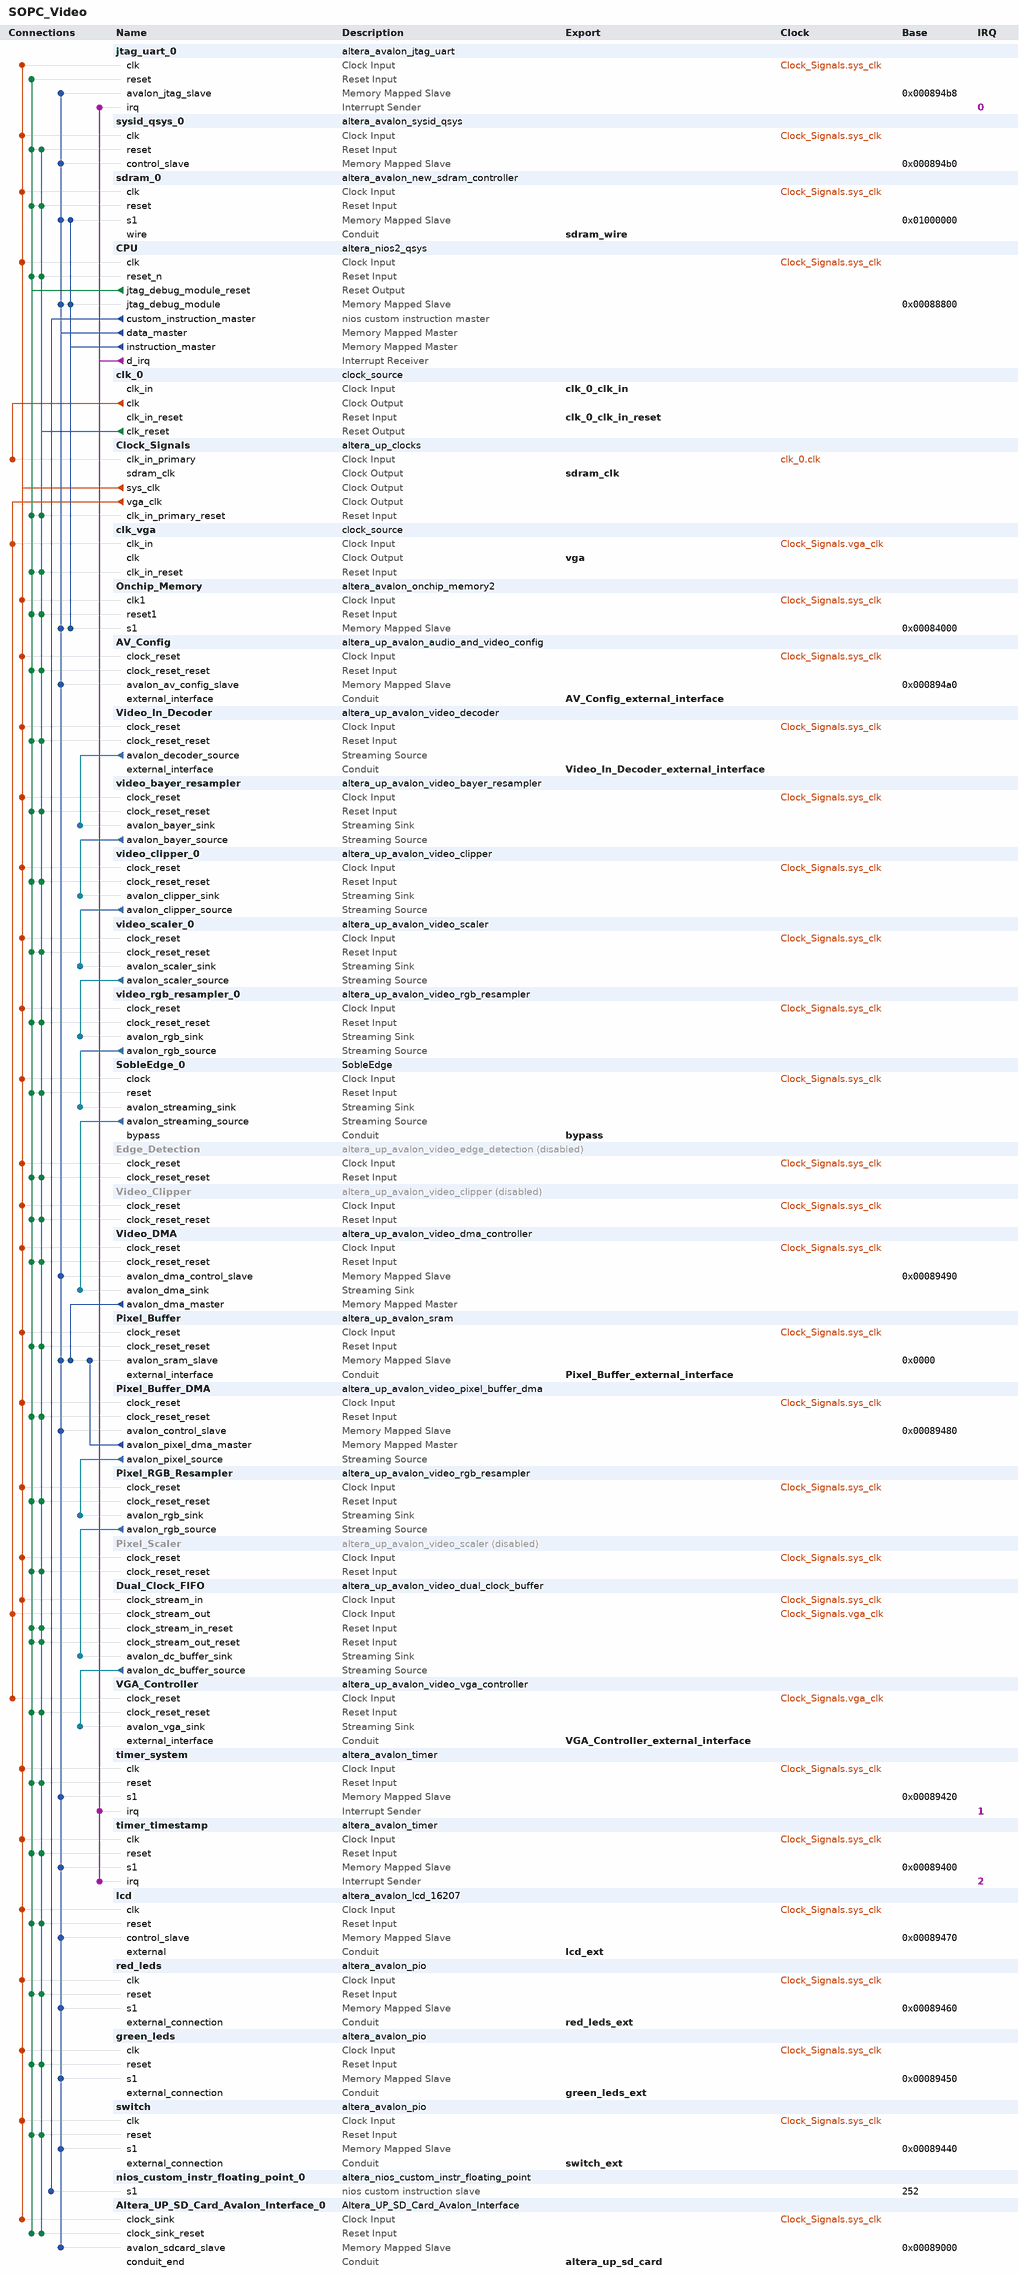
[diagram p0: system contents]
# Platform Designer (Qsys) system SOPC_Video, Cyclone II EP2C35F672C6
# Parameters at their usual value, and those the tool derives, are not listed.
package require -exact qsys 12.0
create_system SOPC_Video
set_project_property DEVICE_FAMILY {Cyclone II}
set_project_property DEVICE EP2C35F672C6

add_instance jtag_uart_0 altera_avalon_jtag_uart 12.1
set_instance_parameter_value jtag_uart_0 simInteractiveOptions INTERACTIVE_ASCII_OUTPUT

add_instance sysid_qsys_0 altera_avalon_sysid_qsys 12.1
set_instance_parameter_value sysid_qsys_0 id 287454020

add_instance sdram_0 altera_avalon_new_sdram_controller 12.1
set_instance_parameter_value sdram_0 TAC 5.5
set_instance_parameter_value sdram_0 TRCD 20.0
set_instance_parameter_value sdram_0 TRP 20.0
set_instance_parameter_value sdram_0 casLatency 3
set_instance_parameter_value sdram_0 columnWidth 8
set_instance_parameter_value sdram_0 dataWidth 16
set_instance_parameter_value sdram_0 generateSimulationModel false
set_instance_parameter_value sdram_0 model custom
set_instance_parameter_value sdram_0 numberOfBanks 4
set_instance_parameter_value sdram_0 numberOfChipSelects 1
set_instance_parameter_value sdram_0 powerUpDelay 100.0
set_instance_parameter_value sdram_0 refreshPeriod 15.625
set_instance_parameter_value sdram_0 rowWidth 12

add_instance CPU altera_nios2_qsys 12.1
set_instance_parameter_value CPU muldiv_divider true
set_instance_parameter_value CPU manuallyAssignCpuID false
set_instance_parameter_value CPU resetSlave sdram_0.s1
set_instance_parameter_value CPU exceptionSlave sdram_0.s1
set_instance_parameter_value CPU breakSlave CPU.jtag_debug_module
set_instance_parameter_value CPU impl Small
set_instance_parameter_value CPU icache_size 4096
set_instance_parameter_value CPU debug_level Level2

add_instance clk_0 clock_source 12.1
set_instance_parameter_value clk_0 clockFrequency 50000000

add_instance Clock_Signals altera_up_clocks 12.0
set_instance_parameter_value Clock_Signals board DE2
set_instance_parameter_value Clock_Signals vga_clk true
set_instance_parameter_value Clock_Signals audio_clk false
set_instance_parameter_value Clock_Signals audio_clk_freq 12.288

add_instance clk_vga clock_source 12.1
set_instance_parameter_value clk_vga clockFrequency 25000000

add_instance Onchip_Memory altera_avalon_onchip_memory2 12.1
set_instance_parameter_value Onchip_Memory dataWidth 32
set_instance_parameter_value Onchip_Memory dualPort false
set_instance_parameter_value Onchip_Memory initMemContent true
set_instance_parameter_value Onchip_Memory initializationFileName Onchip_Memory
set_instance_parameter_value Onchip_Memory memorySize 16384

add_instance AV_Config altera_up_avalon_audio_and_video_config 12.0
set_instance_parameter_value AV_Config board DE2
set_instance_parameter_value AV_Config audio_in {Microphone to ADC}
set_instance_parameter_value AV_Config line_in_bypass false
set_instance_parameter_value AV_Config bit_length 24
set_instance_parameter_value AV_Config sampling_rate {48 kHz}
set_instance_parameter_value AV_Config video_format PAL

add_instance Video_In_Decoder altera_up_avalon_video_decoder 12.0
set_instance_parameter_value Video_In_Decoder video_source {5MP Daughtercard (THDB_D5M)}

add_instance video_bayer_resampler altera_up_avalon_video_bayer_resampler 12.0
set_instance_parameter_value video_bayer_resampler use_custom_format true
set_instance_parameter_value video_bayer_resampler custom_width_in 1280
set_instance_parameter_value video_bayer_resampler custom_height_in 1024

add_instance video_clipper_0 altera_up_avalon_video_clipper 12.0
set_instance_parameter_value video_clipper_0 width_in 1296
set_instance_parameter_value video_clipper_0 height_in 972
set_instance_parameter_value video_clipper_0 drop_left 8
set_instance_parameter_value video_clipper_0 drop_right 8
set_instance_parameter_value video_clipper_0 drop_top 6
set_instance_parameter_value video_clipper_0 drop_bottom 6
set_instance_parameter_value video_clipper_0 color_bits 8
set_instance_parameter_value video_clipper_0 color_planes 3

add_instance video_scaler_0 altera_up_avalon_video_scaler 12.0
set_instance_parameter_value video_scaler_0 width_scaling 0.5
set_instance_parameter_value video_scaler_0 height_scaling 0.5
set_instance_parameter_value video_scaler_0 width_in 1280
set_instance_parameter_value video_scaler_0 height_in 960
set_instance_parameter_value video_scaler_0 color_bits 8
set_instance_parameter_value video_scaler_0 color_planes 3

add_instance video_rgb_resampler_0 altera_up_avalon_video_rgb_resampler 12.0
set_instance_parameter_value video_rgb_resampler_0 input_type {24-bit RGB}
set_instance_parameter_value video_rgb_resampler_0 output_type {8-bit Grayscale}
set_instance_parameter_value video_rgb_resampler_0 alpha 1023

add_instance SobleEdge_0 SobleEdge 1.0
set_instance_parameter_value SobleEdge_0 WIDTH 640

add_instance Edge_Detection altera_up_avalon_video_edge_detection 12.0
set_instance_property Edge_Detection ENABLED false
set_instance_parameter_value Edge_Detection width 640
set_instance_parameter_value Edge_Detection intensity 1

add_instance Video_Clipper altera_up_avalon_video_clipper 12.0
set_instance_property Video_Clipper ENABLED false
set_instance_parameter_value Video_Clipper width_in 800
set_instance_parameter_value Video_Clipper height_in 600
set_instance_parameter_value Video_Clipper drop_left 80
set_instance_parameter_value Video_Clipper drop_right 80
set_instance_parameter_value Video_Clipper drop_top 60
set_instance_parameter_value Video_Clipper drop_bottom 60
set_instance_parameter_value Video_Clipper color_bits 8
set_instance_parameter_value Video_Clipper color_planes 1

add_instance Video_DMA altera_up_avalon_video_dma_controller 12.0
set_instance_parameter_value Video_DMA mode {From Stream to Memory}
set_instance_parameter_value Video_DMA addr_mode X-Y
set_instance_parameter_value Video_DMA start_address 0
set_instance_parameter_value Video_DMA back_start_address 0
set_instance_parameter_value Video_DMA width 640
set_instance_parameter_value Video_DMA height 480
set_instance_parameter_value Video_DMA color_bits 8
set_instance_parameter_value Video_DMA color_planes 1

add_instance Pixel_Buffer altera_up_avalon_sram 12.0
set_instance_parameter_value Pixel_Buffer board DE2
set_instance_parameter_value Pixel_Buffer pixel_buffer true

add_instance Pixel_Buffer_DMA altera_up_avalon_video_pixel_buffer_dma 12.0
set_instance_parameter_value Pixel_Buffer_DMA addr_mode X-Y
set_instance_parameter_value Pixel_Buffer_DMA start_address 0
set_instance_parameter_value Pixel_Buffer_DMA back_start_address 0
set_instance_parameter_value Pixel_Buffer_DMA image_width 640
set_instance_parameter_value Pixel_Buffer_DMA image_height 480
set_instance_parameter_value Pixel_Buffer_DMA color_space {8-bit Grayscale}

add_instance Pixel_RGB_Resampler altera_up_avalon_video_rgb_resampler 12.0
set_instance_parameter_value Pixel_RGB_Resampler input_type {8-bit Grayscale}
set_instance_parameter_value Pixel_RGB_Resampler output_type {30-bit RGB}
set_instance_parameter_value Pixel_RGB_Resampler alpha 255

add_instance Pixel_Scaler altera_up_avalon_video_scaler 12.0
set_instance_property Pixel_Scaler ENABLED false
set_instance_parameter_value Pixel_Scaler width_scaling 1
set_instance_parameter_value Pixel_Scaler height_scaling 1
set_instance_parameter_value Pixel_Scaler width_in 640
set_instance_parameter_value Pixel_Scaler height_in 480
set_instance_parameter_value Pixel_Scaler color_bits 10
set_instance_parameter_value Pixel_Scaler color_planes 3

add_instance Dual_Clock_FIFO altera_up_avalon_video_dual_clock_buffer 12.0
set_instance_parameter_value Dual_Clock_FIFO color_bits 10

add_instance VGA_Controller altera_up_avalon_video_vga_controller 12.0
set_instance_parameter_value VGA_Controller board DE2

add_instance timer_system altera_avalon_timer 12.1
set_instance_parameter_value timer_system period 1
set_instance_parameter_value timer_system periodUnits MSEC
set_instance_parameter_value timer_system timerPreset FULL_FEATURED

add_instance timer_timestamp altera_avalon_timer 12.1
set_instance_parameter_value timer_timestamp period 1
set_instance_parameter_value timer_timestamp periodUnits MSEC
set_instance_parameter_value timer_timestamp timerPreset FULL_FEATURED

add_instance lcd altera_avalon_lcd_16207 12.1

add_instance red_leds altera_avalon_pio 12.1
set_instance_parameter_value red_leds direction Output
set_instance_parameter_value red_leds width 8

add_instance green_leds altera_avalon_pio 12.1
set_instance_parameter_value green_leds direction Output
set_instance_parameter_value green_leds width 8

add_instance switch altera_avalon_pio 12.1
set_instance_parameter_value switch direction Input
set_instance_parameter_value switch width 8

add_instance nios_custom_instr_floating_point_0 altera_nios_custom_instr_floating_point 12.1
set_instance_parameter_value nios_custom_instr_floating_point_0 useDivider 0

add_instance Altera_UP_SD_Card_Avalon_Interface_0 Altera_UP_SD_Card_Avalon_Interface 1.0

# connections
add_connection clk_0.clk Clock_Signals.clk_in_primary clock
add_connection Clock_Signals.sys_clk Altera_UP_SD_Card_Avalon_Interface_0.clock_sink clock
add_connection Clock_Signals.sys_clk AV_Config.clock_reset clock
add_connection Clock_Signals.sys_clk CPU.clk clock
add_connection Clock_Signals.sys_clk Dual_Clock_FIFO.clock_stream_in clock
add_connection Clock_Signals.sys_clk Edge_Detection.clock_reset clock
add_connection Clock_Signals.sys_clk green_leds.clk clock
add_connection Clock_Signals.sys_clk jtag_uart_0.clk clock
add_connection Clock_Signals.sys_clk lcd.clk clock
add_connection Clock_Signals.sys_clk Onchip_Memory.clk1 clock
add_connection Clock_Signals.sys_clk Pixel_Buffer.clock_reset clock
add_connection Clock_Signals.sys_clk Pixel_Buffer_DMA.clock_reset clock
add_connection Clock_Signals.sys_clk Pixel_RGB_Resampler.clock_reset clock
add_connection Clock_Signals.sys_clk Pixel_Scaler.clock_reset clock
add_connection Clock_Signals.sys_clk red_leds.clk clock
add_connection Clock_Signals.sys_clk sdram_0.clk clock
add_connection Clock_Signals.sys_clk SobleEdge_0.clock clock
add_connection Clock_Signals.sys_clk switch.clk clock
add_connection Clock_Signals.sys_clk sysid_qsys_0.clk clock
add_connection Clock_Signals.sys_clk timer_system.clk clock
add_connection Clock_Signals.sys_clk timer_timestamp.clk clock
add_connection Clock_Signals.sys_clk video_bayer_resampler.clock_reset clock
add_connection Clock_Signals.sys_clk Video_Clipper.clock_reset clock
add_connection Clock_Signals.sys_clk video_clipper_0.clock_reset clock
add_connection Clock_Signals.sys_clk Video_DMA.clock_reset clock
add_connection Clock_Signals.sys_clk Video_In_Decoder.clock_reset clock
add_connection Clock_Signals.sys_clk video_rgb_resampler_0.clock_reset clock
add_connection Clock_Signals.sys_clk video_scaler_0.clock_reset clock
add_connection Clock_Signals.vga_clk clk_vga.clk_in clock
add_connection Clock_Signals.vga_clk Dual_Clock_FIFO.clock_stream_out clock
add_connection Clock_Signals.vga_clk VGA_Controller.clock_reset clock
add_connection clk_0.clk_reset Altera_UP_SD_Card_Avalon_Interface_0.clock_sink_reset reset
add_connection clk_0.clk_reset AV_Config.clock_reset_reset reset
add_connection clk_0.clk_reset clk_vga.clk_in_reset reset
add_connection clk_0.clk_reset Clock_Signals.clk_in_primary_reset reset
add_connection clk_0.clk_reset CPU.reset_n reset
add_connection clk_0.clk_reset Dual_Clock_FIFO.clock_stream_in_reset reset
add_connection clk_0.clk_reset Dual_Clock_FIFO.clock_stream_out_reset reset
add_connection clk_0.clk_reset Edge_Detection.clock_reset_reset reset
add_connection clk_0.clk_reset green_leds.reset reset
add_connection clk_0.clk_reset lcd.reset reset
add_connection clk_0.clk_reset Onchip_Memory.reset1 reset
add_connection clk_0.clk_reset Pixel_Buffer.clock_reset_reset reset
add_connection clk_0.clk_reset Pixel_Buffer_DMA.clock_reset_reset reset
add_connection clk_0.clk_reset Pixel_RGB_Resampler.clock_reset_reset reset
add_connection clk_0.clk_reset Pixel_Scaler.clock_reset_reset reset
add_connection clk_0.clk_reset red_leds.reset reset
add_connection clk_0.clk_reset sdram_0.reset reset
add_connection clk_0.clk_reset SobleEdge_0.reset reset
add_connection clk_0.clk_reset switch.reset reset
add_connection clk_0.clk_reset sysid_qsys_0.reset reset
add_connection clk_0.clk_reset timer_system.reset reset
add_connection clk_0.clk_reset timer_timestamp.reset reset
add_connection clk_0.clk_reset VGA_Controller.clock_reset_reset reset
add_connection clk_0.clk_reset video_bayer_resampler.clock_reset_reset reset
add_connection clk_0.clk_reset Video_Clipper.clock_reset_reset reset
add_connection clk_0.clk_reset video_clipper_0.clock_reset_reset reset
add_connection clk_0.clk_reset Video_DMA.clock_reset_reset reset
add_connection clk_0.clk_reset Video_In_Decoder.clock_reset_reset reset
add_connection clk_0.clk_reset video_rgb_resampler_0.clock_reset_reset reset
add_connection clk_0.clk_reset video_scaler_0.clock_reset_reset reset
add_connection CPU.jtag_debug_module_reset Altera_UP_SD_Card_Avalon_Interface_0.clock_sink_reset reset
add_connection CPU.jtag_debug_module_reset AV_Config.clock_reset_reset reset
add_connection CPU.jtag_debug_module_reset clk_vga.clk_in_reset reset
add_connection CPU.jtag_debug_module_reset Clock_Signals.clk_in_primary_reset reset
add_connection CPU.jtag_debug_module_reset CPU.reset_n reset
add_connection CPU.jtag_debug_module_reset Dual_Clock_FIFO.clock_stream_in_reset reset
add_connection CPU.jtag_debug_module_reset Dual_Clock_FIFO.clock_stream_out_reset reset
add_connection CPU.jtag_debug_module_reset Edge_Detection.clock_reset_reset reset
add_connection CPU.jtag_debug_module_reset green_leds.reset reset
add_connection CPU.jtag_debug_module_reset jtag_uart_0.reset reset
add_connection CPU.jtag_debug_module_reset lcd.reset reset
add_connection CPU.jtag_debug_module_reset Onchip_Memory.reset1 reset
add_connection CPU.jtag_debug_module_reset Pixel_Buffer.clock_reset_reset reset
add_connection CPU.jtag_debug_module_reset Pixel_Buffer_DMA.clock_reset_reset reset
add_connection CPU.jtag_debug_module_reset Pixel_RGB_Resampler.clock_reset_reset reset
add_connection CPU.jtag_debug_module_reset Pixel_Scaler.clock_reset_reset reset
add_connection CPU.jtag_debug_module_reset red_leds.reset reset
add_connection CPU.jtag_debug_module_reset sdram_0.reset reset
add_connection CPU.jtag_debug_module_reset SobleEdge_0.reset reset
add_connection CPU.jtag_debug_module_reset switch.reset reset
add_connection CPU.jtag_debug_module_reset sysid_qsys_0.reset reset
add_connection CPU.jtag_debug_module_reset timer_system.reset reset
add_connection CPU.jtag_debug_module_reset timer_timestamp.reset reset
add_connection CPU.jtag_debug_module_reset VGA_Controller.clock_reset_reset reset
add_connection CPU.jtag_debug_module_reset video_bayer_resampler.clock_reset_reset reset
add_connection CPU.jtag_debug_module_reset Video_Clipper.clock_reset_reset reset
add_connection CPU.jtag_debug_module_reset video_clipper_0.clock_reset_reset reset
add_connection CPU.jtag_debug_module_reset Video_DMA.clock_reset_reset reset
add_connection CPU.jtag_debug_module_reset Video_In_Decoder.clock_reset_reset reset
add_connection CPU.jtag_debug_module_reset video_rgb_resampler_0.clock_reset_reset reset
add_connection CPU.jtag_debug_module_reset video_scaler_0.clock_reset_reset reset
add_connection CPU.data_master Altera_UP_SD_Card_Avalon_Interface_0.avalon_sdcard_slave avalon
set_connection_parameter_value CPU.data_master/Altera_UP_SD_Card_Avalon_Interface_0.avalon_sdcard_slave baseAddress 0x00089000
add_connection CPU.data_master AV_Config.avalon_av_config_slave avalon
set_connection_parameter_value CPU.data_master/AV_Config.avalon_av_config_slave baseAddress 0x000894a0
add_connection CPU.data_master CPU.jtag_debug_module avalon
set_connection_parameter_value CPU.data_master/CPU.jtag_debug_module baseAddress 0x00088800
add_connection CPU.data_master green_leds.s1 avalon
set_connection_parameter_value CPU.data_master/green_leds.s1 baseAddress 0x00089450
add_connection CPU.data_master jtag_uart_0.avalon_jtag_slave avalon
set_connection_parameter_value CPU.data_master/jtag_uart_0.avalon_jtag_slave baseAddress 0x000894b8
add_connection CPU.data_master lcd.control_slave avalon
set_connection_parameter_value CPU.data_master/lcd.control_slave baseAddress 0x00089470
add_connection CPU.data_master Onchip_Memory.s1 avalon
set_connection_parameter_value CPU.data_master/Onchip_Memory.s1 baseAddress 0x00084000
add_connection CPU.data_master Pixel_Buffer.avalon_sram_slave avalon
set_connection_parameter_value CPU.data_master/Pixel_Buffer.avalon_sram_slave baseAddress 0x0000
add_connection CPU.data_master Pixel_Buffer_DMA.avalon_control_slave avalon
set_connection_parameter_value CPU.data_master/Pixel_Buffer_DMA.avalon_control_slave baseAddress 0x00089480
add_connection CPU.data_master red_leds.s1 avalon
set_connection_parameter_value CPU.data_master/red_leds.s1 baseAddress 0x00089460
add_connection CPU.data_master sdram_0.s1 avalon
set_connection_parameter_value CPU.data_master/sdram_0.s1 baseAddress 0x01000000
add_connection CPU.data_master switch.s1 avalon
set_connection_parameter_value CPU.data_master/switch.s1 baseAddress 0x00089440
add_connection CPU.data_master sysid_qsys_0.control_slave avalon
set_connection_parameter_value CPU.data_master/sysid_qsys_0.control_slave baseAddress 0x000894b0
add_connection CPU.data_master timer_system.s1 avalon
set_connection_parameter_value CPU.data_master/timer_system.s1 baseAddress 0x00089420
add_connection CPU.data_master timer_timestamp.s1 avalon
set_connection_parameter_value CPU.data_master/timer_timestamp.s1 baseAddress 0x00089400
add_connection CPU.data_master Video_DMA.avalon_dma_control_slave avalon
set_connection_parameter_value CPU.data_master/Video_DMA.avalon_dma_control_slave baseAddress 0x00089490
add_connection CPU.instruction_master CPU.jtag_debug_module avalon
set_connection_parameter_value CPU.instruction_master/CPU.jtag_debug_module baseAddress 0x00088800
add_connection CPU.instruction_master Onchip_Memory.s1 avalon
set_connection_parameter_value CPU.instruction_master/Onchip_Memory.s1 baseAddress 0x00084000
add_connection CPU.instruction_master sdram_0.s1 avalon
set_connection_parameter_value CPU.instruction_master/sdram_0.s1 baseAddress 0x01000000
add_connection Pixel_Buffer_DMA.avalon_pixel_dma_master Pixel_Buffer.avalon_sram_slave avalon
set_connection_parameter_value Pixel_Buffer_DMA.avalon_pixel_dma_master/Pixel_Buffer.avalon_sram_slave baseAddress 0x0000
add_connection Video_DMA.avalon_dma_master Pixel_Buffer.avalon_sram_slave avalon
set_connection_parameter_value Video_DMA.avalon_dma_master/Pixel_Buffer.avalon_sram_slave baseAddress 0x0000
add_connection Dual_Clock_FIFO.avalon_dc_buffer_source VGA_Controller.avalon_vga_sink avalon_streaming
add_connection Pixel_Buffer_DMA.avalon_pixel_source Pixel_RGB_Resampler.avalon_rgb_sink avalon_streaming
add_connection Pixel_RGB_Resampler.avalon_rgb_source Dual_Clock_FIFO.avalon_dc_buffer_sink avalon_streaming
add_connection SobleEdge_0.avalon_streaming_source Video_DMA.avalon_dma_sink avalon_streaming
add_connection video_bayer_resampler.avalon_bayer_source video_clipper_0.avalon_clipper_sink avalon_streaming
add_connection video_clipper_0.avalon_clipper_source video_scaler_0.avalon_scaler_sink avalon_streaming
add_connection Video_In_Decoder.avalon_decoder_source video_bayer_resampler.avalon_bayer_sink avalon_streaming
add_connection video_rgb_resampler_0.avalon_rgb_source SobleEdge_0.avalon_streaming_sink avalon_streaming
add_connection video_scaler_0.avalon_scaler_source video_rgb_resampler_0.avalon_rgb_sink avalon_streaming
add_connection CPU.d_irq jtag_uart_0.irq interrupt
set_connection_parameter_value CPU.d_irq/jtag_uart_0.irq irqNumber 0
add_connection CPU.d_irq timer_system.irq interrupt
set_connection_parameter_value CPU.d_irq/timer_system.irq irqNumber 1
add_connection CPU.d_irq timer_timestamp.irq interrupt
set_connection_parameter_value CPU.d_irq/timer_timestamp.irq irqNumber 2
add_connection CPU.custom_instruction_master nios_custom_instr_floating_point_0.s1 nios_custom_instruction
set_connection_parameter_value CPU.custom_instruction_master/nios_custom_instr_floating_point_0.s1 CIName nios_custom_instr_floating_point_0
set_connection_parameter_value CPU.custom_instruction_master/nios_custom_instr_floating_point_0.s1 baseAddress 252

# exported interfaces
add_interface VGA_Controller_external_interface conduit end
set_interface_property VGA_Controller_external_interface EXPORT_OF VGA_Controller.external_interface
add_interface clk_0_clk_in clock sink
set_interface_property clk_0_clk_in EXPORT_OF clk_0.clk_in
add_interface clk_0_clk_in_reset reset sink
set_interface_property clk_0_clk_in_reset EXPORT_OF clk_0.clk_in_reset
add_interface AV_Config_external_interface conduit end
set_interface_property AV_Config_external_interface EXPORT_OF AV_Config.external_interface
add_interface Pixel_Buffer_external_interface conduit end
set_interface_property Pixel_Buffer_external_interface EXPORT_OF Pixel_Buffer.external_interface
add_interface Video_In_Decoder_external_interface conduit end
set_interface_property Video_In_Decoder_external_interface EXPORT_OF Video_In_Decoder.external_interface
add_interface vga clock source
set_interface_property vga EXPORT_OF clk_vga.clk
add_interface bypass conduit end
set_interface_property bypass EXPORT_OF SobleEdge_0.bypass
add_interface sdram_wire conduit end
set_interface_property sdram_wire EXPORT_OF sdram_0.wire
add_interface lcd_ext conduit end
set_interface_property lcd_ext EXPORT_OF lcd.external
add_interface red_leds_ext conduit end
set_interface_property red_leds_ext EXPORT_OF red_leds.external_connection
add_interface green_leds_ext conduit end
set_interface_property green_leds_ext EXPORT_OF green_leds.external_connection
add_interface switch_ext conduit end
set_interface_property switch_ext EXPORT_OF switch.external_connection
add_interface altera_up_sd_card conduit end
set_interface_property altera_up_sd_card EXPORT_OF Altera_UP_SD_Card_Avalon_Interface_0.conduit_end
add_interface sdram_clk clock source
set_interface_property sdram_clk EXPORT_OF Clock_Signals.sdram_clk

save_system SOPC_Video.qsys
